# EAGLE design KeyBoard (EAGLE 7.2.0)
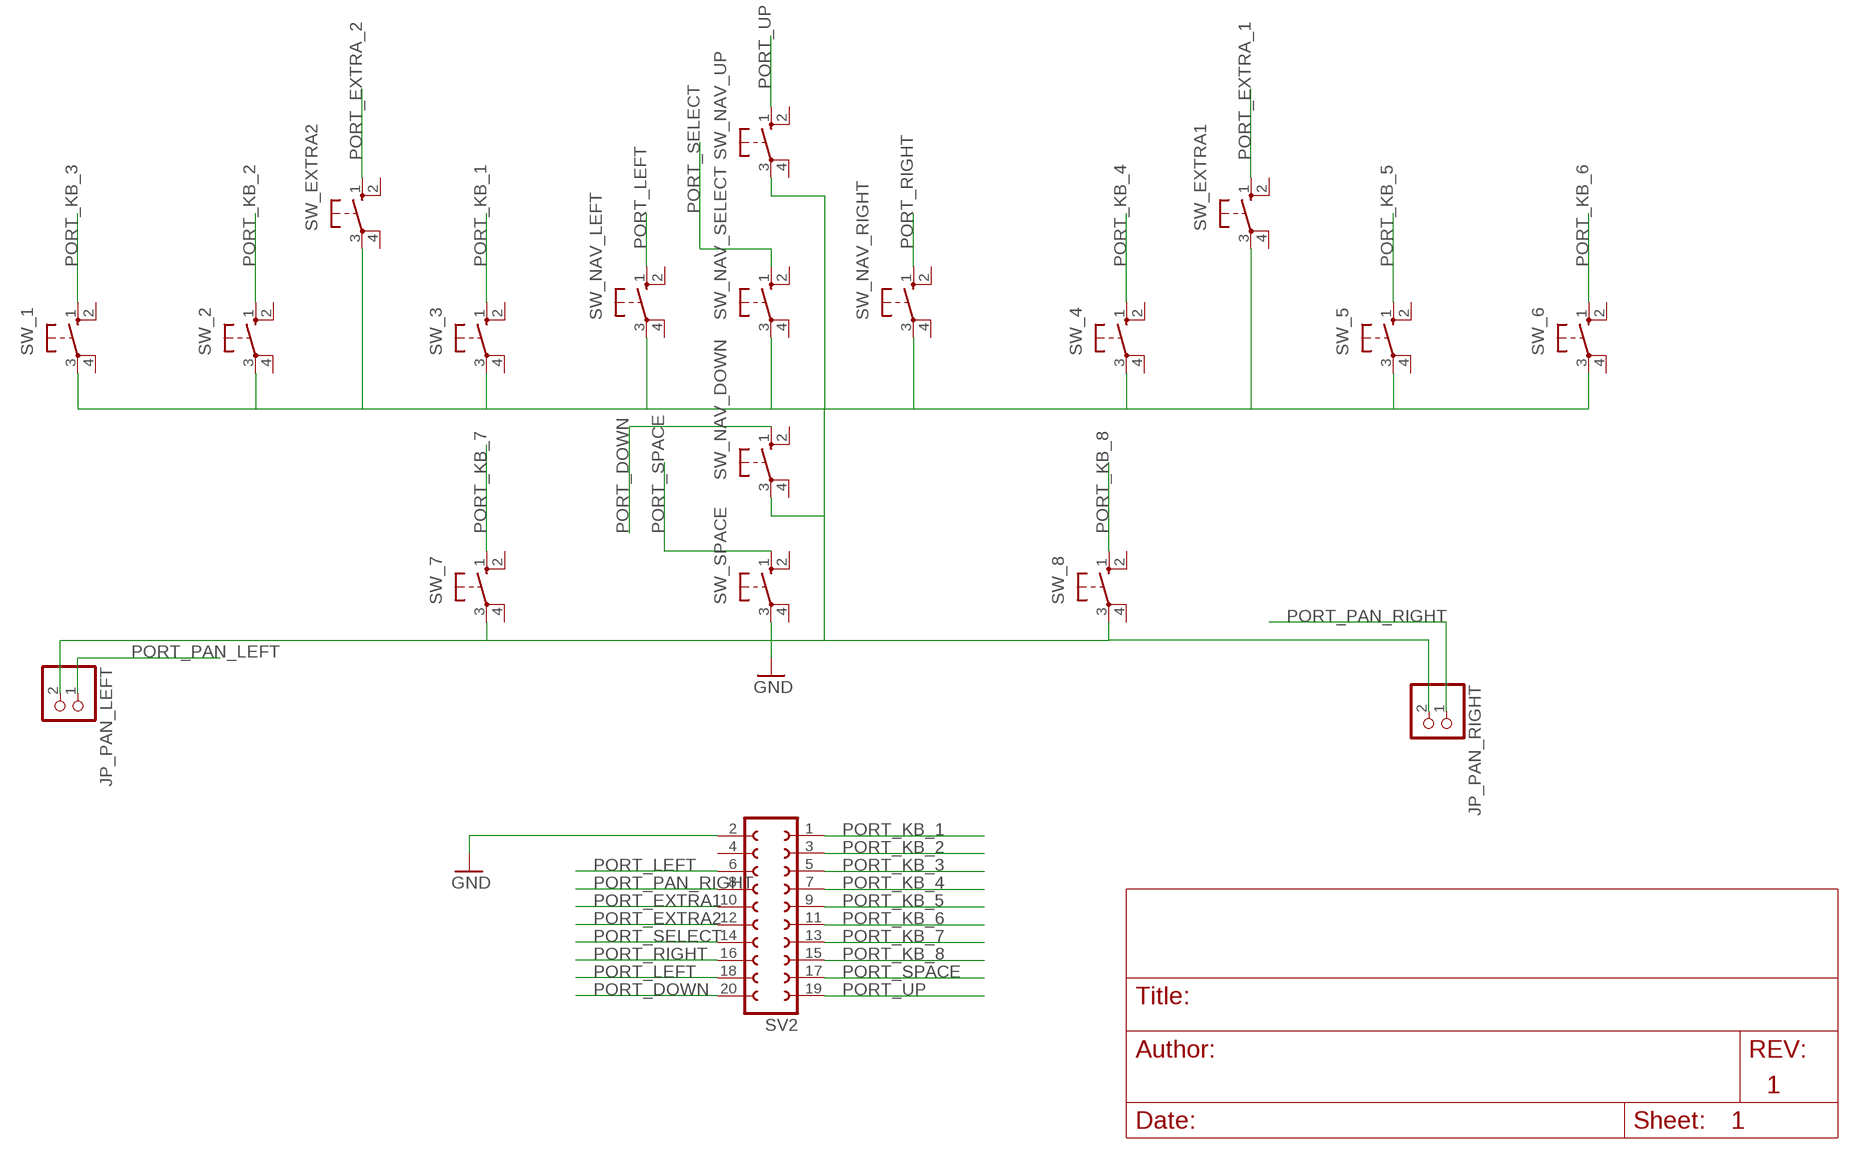
[diagram p0: schematic, sheet 1]
FRAME1 (DINA4_P): AUTHOR: Christoph Ulbinger, BSc; TITLE: Keyboard

## Parts
JP_PAN_LEFT  PINHD-1X2  [1X02]
JP_PAN_RIGHT  PINHD-1X2  [1X02]
SV2  FE10-2  [FE10-2]
SW_1  10-XX  [B3F-10XX]
SW_2  10-XX  [B3F-10XX]
SW_3  10-XX  [B3F-10XX]
SW_4  10-XX  [B3F-10XX]
SW_5  10-XX  [B3F-10XX]
SW_6  10-XX  [B3F-10XX]
SW_7  10-XX  [B3F-10XX]
SW_8  10-XX  [B3F-10XX]
SW_EXTRA1  10-XX  [B3F-10XX]
SW_EXTRA2  10-XX  [B3F-10XX]
SW_NAV_DOWN  10-XX  [B3F-10XX]
SW_NAV_LEFT  10-XX  [B3F-10XX]
SW_NAV_RIGHT  10-XX  [B3F-10XX]
SW_NAV_SELECT  10-XX  [B3F-10XX]
SW_NAV_UP  10-XX  [B3F-10XX]
SW_SPACE  10-XX  [B3F-10XX]

## Nets
GND: JP_PAN_LEFT.2 JP_PAN_RIGHT.2 SV2.2 SW_1.3(P) SW_2.3(P) SW_3.3(P) SW_4.3(P) SW_5.3(P) SW_6.3(P) SW_7.3(P) SW_8.3(P) SW_EXTRA1.3(P) SW_EXTRA2.3(P) SW_NAV_DOWN.3(P) SW_NAV_LEFT.3(P) SW_NAV_RIGHT.3(P) SW_NAV_SELECT.3(P) SW_NAV_UP.3(P) SW_SPACE.3(P)
PORT_DOWN: SV2.20 SW_NAV_DOWN.1(S)
PORT_EXTRA1: SV2.10
PORT_EXTRA2: SV2.12
PORT_EXTRA_1: SW_EXTRA1.1(S)
PORT_EXTRA_2: SW_EXTRA2.1(S)
PORT_KB_1: SV2.1 SW_3.1(S)
PORT_KB_2: SV2.3 SW_2.1(S)
PORT_KB_3: SV2.5 SW_1.1(S)
PORT_KB_4: SV2.7 SW_4.1(S)
PORT_KB_5: SV2.9 SW_5.1(S)
PORT_KB_6: SV2.11 SW_6.1(S)
PORT_KB_7: SV2.13 SW_7.1(S)
PORT_KB_8: SV2.15 SW_8.1(S)
PORT_LEFT: SV2.6 SV2.18 SW_NAV_LEFT.1(S)
PORT_PAN_LEFT: JP_PAN_LEFT.1
PORT_PAN_RIGHT: JP_PAN_RIGHT.1 SV2.8
PORT_RIGHT: SV2.16 SW_NAV_RIGHT.1(S)
PORT_SELECT: SV2.14 SW_NAV_SELECT.1(S)
PORT_SPACE: SV2.17 SW_SPACE.1(S)
PORT_UP: SV2.19 SW_NAV_UP.1(S)
Unconnected: SV2.4 SW_1.2(S1) SW_1.4(P1) SW_2.2(S1) SW_2.4(P1) SW_3.2(S1) SW_3.4(P1) SW_4.2(S1) SW_4.4(P1) SW_5.2(S1) SW_5.4(P1) SW_6.2(S1) SW_6.4(P1) SW_7.2(S1) SW_7.4(P1) SW_8.2(S1) SW_8.4(P1) SW_EXTRA1.2(S1) SW_EXTRA1.4(P1) SW_EXTRA2.2(S1) SW_EXTRA2.4(P1) SW_NAV_DOWN.2(S1) SW_NAV_DOWN.4(P1) SW_NAV_LEFT.2(S1) SW_NAV_LEFT.4(P1) SW_NAV_RIGHT.2(S1) SW_NAV_RIGHT.4(P1) SW_NAV_SELECT.2(S1) SW_NAV_SELECT.4(P1) SW_NAV_UP.2(S1) SW_NAV_UP.4(P1) SW_SPACE.2(S1) SW_SPACE.4(P1)

## Library data of the parts
JP_PAN_LEFT JP_PAN_RIGHT = pinhead:PINHD-1X2: PIN HEADER
SV2 = con-lsta:FE10-2: FEMALE HEADER; OC_FARNELL: unknown; OC_NEWARK: unknown
SW_1-SW_8 SW_EXTRA1 SW_EXTRA2 SW_NAV_DOWN SW_NAV_LEFT SW_NAV_RIGHT SW_NAV_SELECT SW_NAV_UP SW_SPACE = switch-omron:10-XX: OMRON SWITCH; MPN: B3F-1000; OC_FARNELL: 176432; OC_NEWARK: 36M3542

## Board
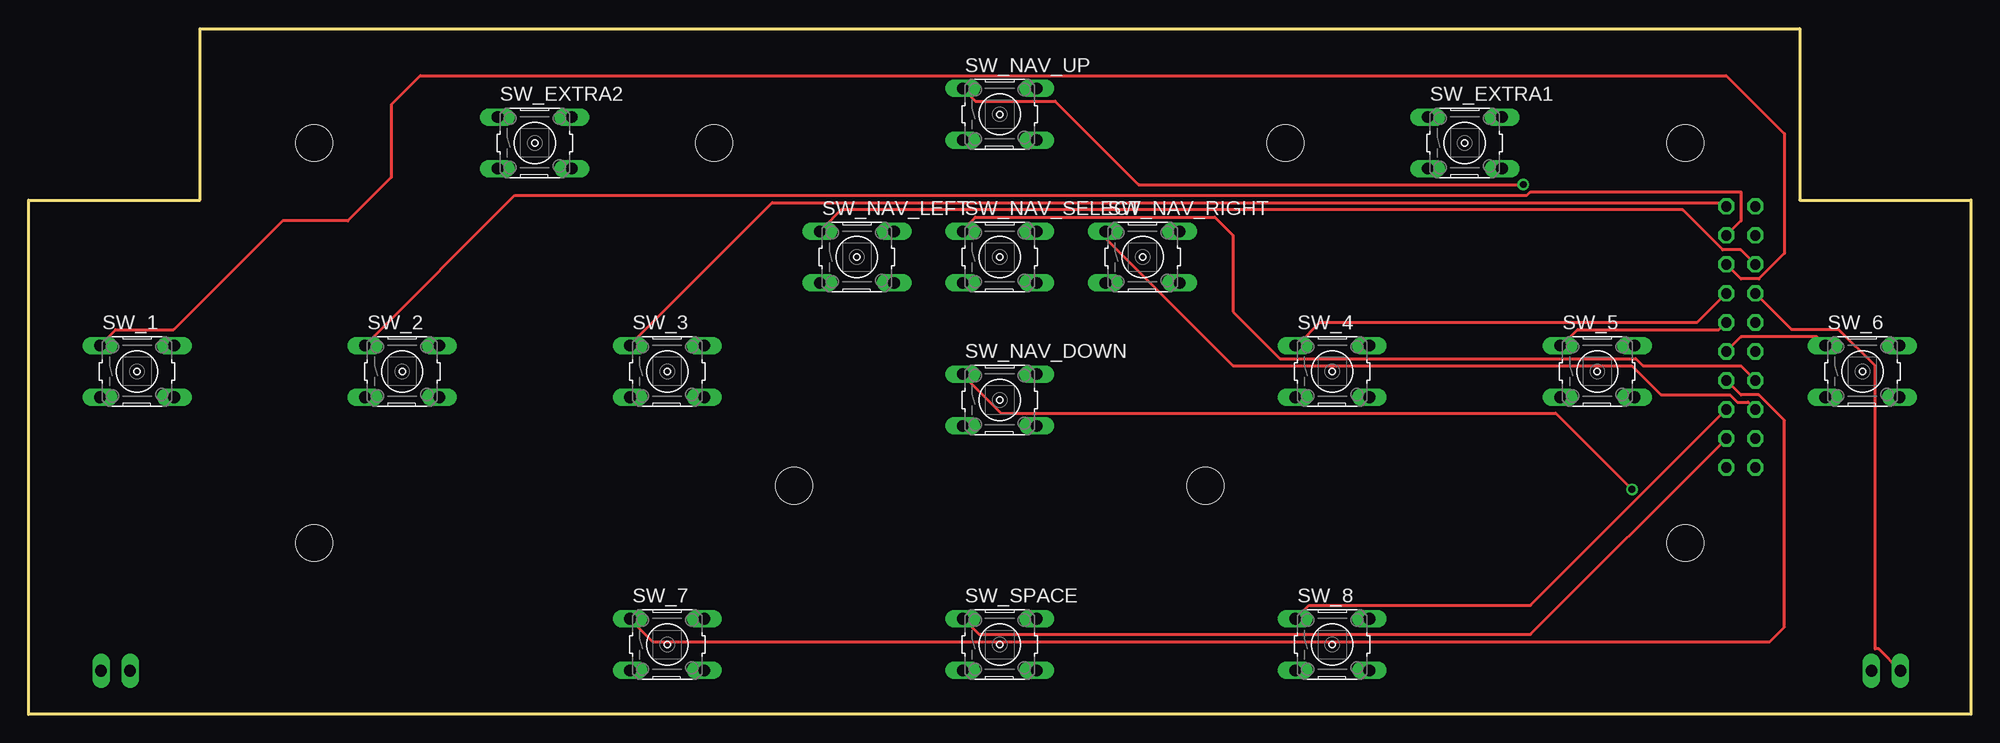
[diagram p1: board, top side]
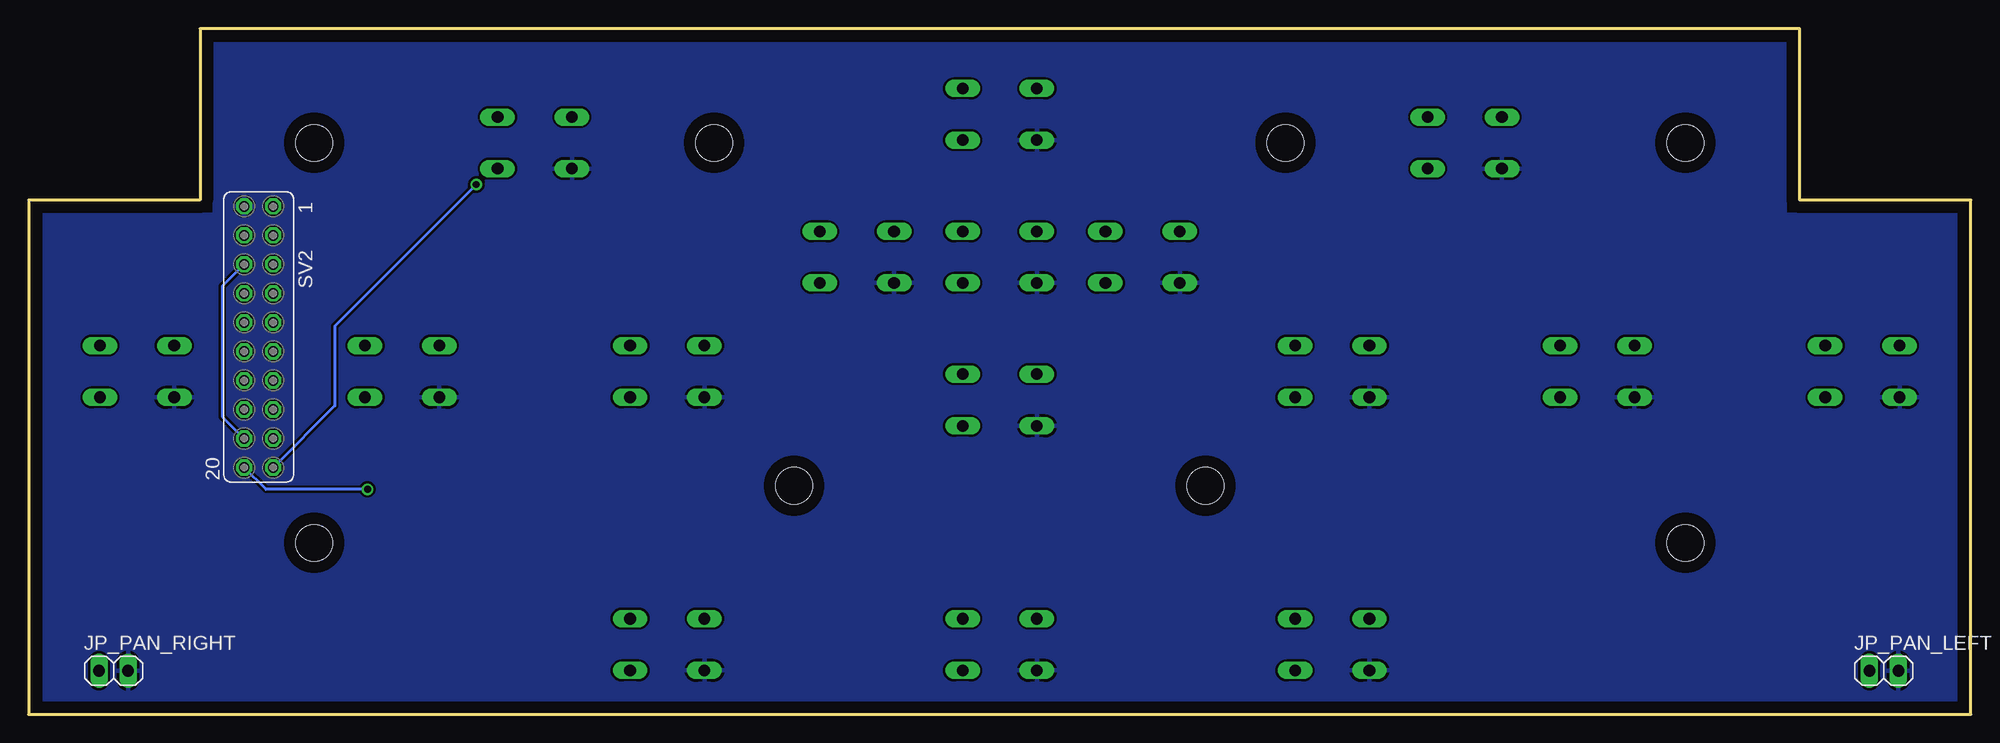
[diagram p2: board, bottom side, seen from below]

Size 170 x 60 mm. Coordinates in mm from the lower left corner, seen from the top.
Outline: 0,45 15,45 15,60 155,60 155,45 170,45 170,0 0,0 0,45
Copper layers (1*16): Top 0.035mm / dielectric 1.5mm / Bottom 0.035mm
Design rules "default": minimum track width 10mil, minimum drill 24mil, track to track 8mil, track to pad 8mil, pad to pad 8mil, via to via 8mil, smd to smd 8mil, copper to edge 40mil, drill to drill 8mil, minimum pad ring 10mil, minimum via ring 8mil, stop-mask expansion 4mil, vias tented up to drill 0mil, thermal gap 10mil
Holes 3.2 mm at 25,50 60,50 110,50 145,50 25,15 103,20 67,20 145,15

### Footprints (pad centres in the part's own frame; a part is rotated, then mirrored left to right if it is on the bottom)
1X02 = drill 1.016 long: 1 -1.27,0; 2 1.27,0
FE10-2 = drill 0.914 octagon: 1 -11.43,1.27; 2 -11.43,-1.27; 3 -8.89,1.27; 4 -8.89,-1.27; 5 -6.35,1.27; 6 -6.35,-1.27; 7 -3.81,1.27; 8 -3.81,-1.27; 9 -1.27,1.27; 10 -1.27,-1.27; 11 1.27,1.27; 12 1.27,-1.27; 13 3.81,1.27; 14 3.81,-1.27; 15 6.35,1.27; 16 6.35,-1.27; 17 8.89,1.27; 18 8.89,-1.27; 19 11.43,1.27; 20 11.43,-1.27
B3F-10XX = drill 1.016 long: 1 -3.251,2.261; 2 3.251,2.261; 3 -3.251,-2.261; 4 3.251,-2.261

### Placement (x,y rotation side)
JP_PAN_LEFT  7.62,3.81 0 bottom
JP_PAN_RIGHT  162.56,3.81 0 bottom
SV2  149.86,33.02 270 bottom
SW_1  9.5,30 0 top
SW_2  32.7,30 0 top
SW_3  55.9,30 0 top
SW_4  114.1,30 0 top
SW_5  137.3,30 0 top
SW_6  160.5,30 0 top
SW_7  55.9,6.1 0 top
SW_8  114.1,6.1 0 top
SW_EXTRA1  125.7,50 0 top
SW_EXTRA2  44.3,50 0 top
SW_NAV_DOWN  85,27.5 0 top
SW_NAV_LEFT  72.5,40 0 top
SW_NAV_RIGHT  97.5,40 0 top
SW_NAV_SELECT  85,40 0 top
SW_NAV_UP  85,52.5 0 top
SW_SPACE  85,6.1 0 top

### Tracks (layer width: path | path; a pad name or v marks a point on that pad's centre or on a via)
GND
  pour Bottom: 1.27,1.27 1.27,43.73 16.27,43.73 16.27,58.73 153.73,58.73 153.73,43.73 168.73,43.73 168.73,1.27
PORT_DOWN  (via drill 0.61)
  Top 0.254: v140.34,19.68 133.67,26.35 85.09,26.35 81.92,29.53 SW_NAV_DOWN.1
  Bottom 0.254: SV2.20 149.22,19.68 v140.34,19.68
PORT_KB_1
  Top 0.254: SV2.1 148.27,44.77 65.09,44.77 52.7,32.38 SW_3.1
PORT_KB_2
  Top 0.254: SV2.3 149.86,43.18 149.86,45.72 131.44,45.72 131.13,45.4 42.55,45.4 29.53,32.38 SW_2.1
PORT_KB_3
  Top 0.254: SV2.5 149.86,38.1 151.45,38.1 153.67,40.32 153.67,50.8 148.59,55.88 34.29,55.88 31.75,53.34 31.75,46.99 27.94,43.18 22.23,43.18 12.7,33.66 7.62,33.66 6.35,32.38 SW_1.1
PORT_KB_4
  Top 0.254: SV2.7 146.05,34.29 113.03,34.29 111.12,32.38 SW_4.1
PORT_KB_5
  Top 0.254: SV2.9 147.96,33.66 135.57,33.66 134.3,32.38 SW_5.1
PORT_KB_6
  Top 0.254: SV2.11 149.86,33.02 156.53,33.02 157.16,32.38 SW_6.1
PORT_KB_7
  Top 0.254: SV2.13 149.86,27.94 151.45,27.94 153.67,25.72 153.67,7.62 152.4,6.35 54.61,6.35 52.7,8.26 SW_7.1
PORT_KB_8
  Top 0.254: SV2.15 131.44,9.53 112.08,9.53 111.12,8.57 SW_8.1
PORT_LEFT
  Top 0.254: SV2.6 149.86,40.64 148.27,40.64 144.78,44.13 71.12,44.13 69.53,42.55 SW_NAV_LEFT.1
  Bottom 0.254: SV2.18 153.03,26.04 153.03,37.47 SV2.6
PORT_PAN_RIGHT
  Top 0.254: SV2.8 154.31,33.66 158.43,33.66 161.61,30.48 161.61,5.71 161.93,5.71 JP_PAN_RIGHT.1
PORT_RIGHT
  Top 0.254: SV2.16 150.5,27.3 149.54,27.3 148.91,27.94 142.88,27.94 140.34,30.48 105.41,30.48 94.3,41.59 94.3,42.23 SW_NAV_RIGHT.1
PORT_SELECT
  Top 0.254: SV2.14 149.86,30.48 141.29,30.48 140.65,31.11 109.54,31.11 105.41,35.24 105.41,41.91 103.82,43.5 82.87,43.5 81.92,42.55 SW_NAV_SELECT.1
PORT_SPACE
  Top 0.254: SV2.17 131.44,6.99 83.19,6.99 81.92,8.26 SW_SPACE.1
PORT_UP  (via drill 0.61)
  Top 0.254: v130.81,46.35 97.16,46.35 89.85,53.66 82.87,53.66 81.92,54.61 SW_NAV_UP.1
  Bottom 0.254: SV2.19 143.19,26.99 143.19,33.97 v130.81,46.35